# EAGLE schematic smartFootballTable (EAGLE 8.1.1)
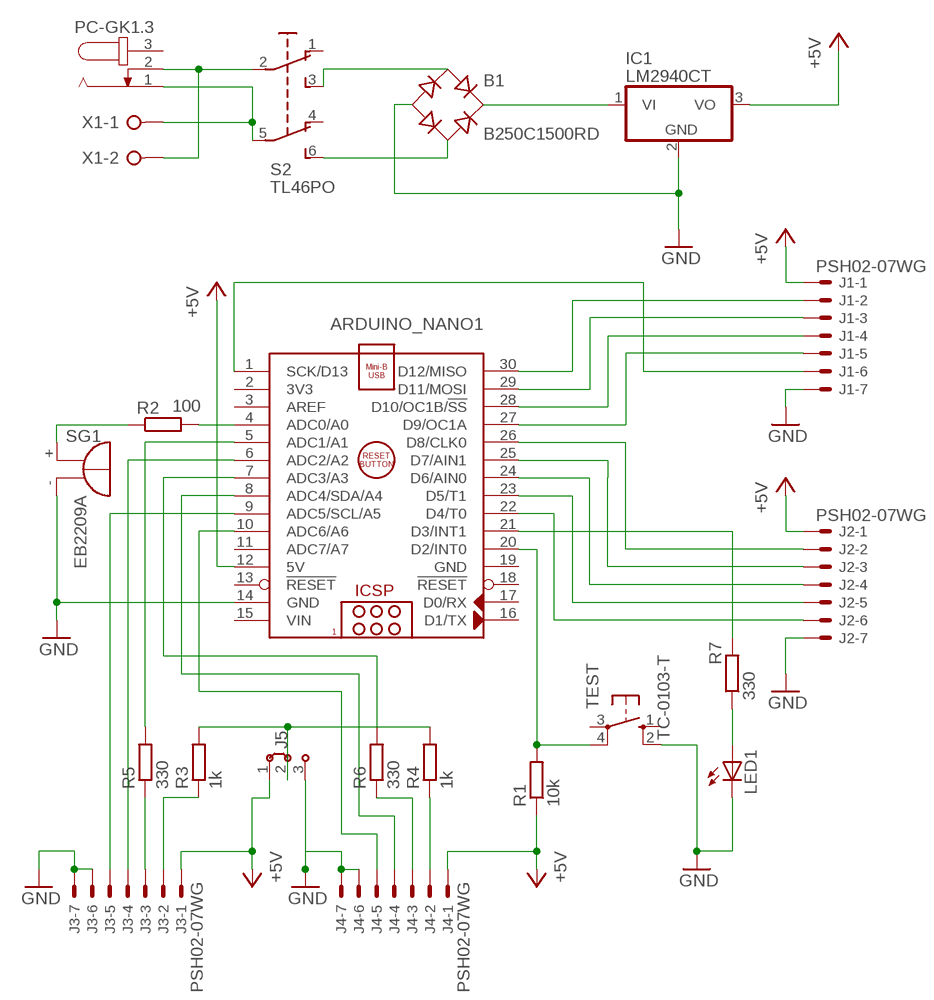
[diagram p0: schematic, sheet 1]

## Parts
ARDUINO_NANO1  ARDUINO_NANO  [ARDUINO_NANO]
B1  B250C1500RD  RECTIFIER-RB1A  [RB1A]
IC1  LM2940CT  LM340H-05  [TO220H]
J1  PSH02-07WG  C-GRID-07-70553  [70553-07]
J2  PSH02-07WG  C-GRID-07-70553  [70553-07]
J3  PSH02-07WG  C-GRID-07-70553  [70553-07]
J4  PSH02-07WG  C-GRID-07-70553  [70553-07]
J5  J2X2MM  [04C]
LED1  LED5MM  [LED5MM]
PC-GK1.3  JACK-PLUG0  [SPC4077]
R1  10k  R-EU_0204/7  [0204/7]
R2  100  R-EU_0204/7  [0204/7]
R3  1k  R-EU_0204/7  [0204/7]
R4  1k  R-EU_0204/7  [0204/7]
R5  330  R-EU_0204/7  [0204/7]
R6  330  R-EU_0204/7  [0204/7]
R7  330  R-EU_0204/7  [0204/7]
S2  TL46PO  [TL4XPO]
SG1  EB2209A  [EB2209A]
TEST  TC-0103-T  40-XX  [B3F-40XX]
X1  W237-02P  [W237-132]

## Nets
+5V: ARDUINO_NANO1.12(5V) IC1.3(VO) J1.1 J2.1 J3.1 J4.1 J5.1 R1.1
A0: ARDUINO_NANO1.4(ADC0/A0) R2.2
A1: ARDUINO_NANO1.5(ADC1/A1) R5.2
A2: ARDUINO_NANO1.6(ADC2/A2) J3.4
A3: ARDUINO_NANO1.7(ADC3/A3) R6.2
A4: ARDUINO_NANO1.8(ADC4/SDA/A4) J4.4
A5: ARDUINO_NANO1.9(ADC5/SCL/A5) J3.5
A6: ARDUINO_NANO1.10(ADC6/A6) J4.5
D2: ARDUINO_NANO1.20(D2/INT0) R1.2 TEST.4(P1)
D3: ARDUINO_NANO1.21(D3/INT1) R7.2
D4: ARDUINO_NANO1.22(D4/T0) J2.6
D5: ARDUINO_NANO1.23(D5/T1) J2.5
D6: ARDUINO_NANO1.24(D6/AIN0) J2.4
D7: ARDUINO_NANO1.25(D7/AIN1) J2.3
D8: ARDUINO_NANO1.26(D8/CLK0) J2.2
D9: ARDUINO_NANO1.27(D9/OC1A) J1.5
D10: ARDUINO_NANO1.28(D10/OC1B/!SS) J1.4
D11: ARDUINO_NANO1.29(D11/MOSI) J1.3
D12: ARDUINO_NANO1.30(D12/MISO) J1.2
D13: ARDUINO_NANO1.1(SCK/D13) J1.6
GND: ARDUINO_NANO1.14(GND) B1.- IC1.2(GND) J1.7 J2.7 J3.6 J3.7 J4.6 J4.7 J5.3 LED1.K(C) SG1.- TEST.2(S1)
N$2: B1.+ IC1.1(VI)
N$3: B1.AC2 S2.6(S1)
N$4: B1.AC1 S2.3(S)
N$8: R2.1 SG1.+
N$16: PC-GK1.3.1 S2.5(P1) X1.1
N$17: PC-GK1.3.2 S2.2(P) X1.2
N$20: J3.2 R3.1
N$21: J4.2 R4.1
N$22: J3.3 R5.1
N$23: J4.3 R6.1
N$25: LED1.A R7.1
N$31: J5.2 R3.2 R4.2
Unconnected: ARDUINO_NANO1.2(3V3) ARDUINO_NANO1.3(AREF) ARDUINO_NANO1.11(ADC7/A7) ARDUINO_NANO1.13(!RESET) ARDUINO_NANO1.16(D1/TX) ARDUINO_NANO1.17(D0/RX) ARDUINO_NANO1.18(!RESET) PC-GK1.3.3 S2.1(O) S2.4(O1) TEST.1(S) TEST.3(P)

## Power pins joined to a net without a drawn wire
GND: ARDUINO_NANO1.19(GND)
VIN: ARDUINO_NANO1.15(VIN)

## Library data of the parts
ARDUINO_NANO1 = ArduinoNanoV30:ARDUINO_NANO: Arduino Nano V3.0 Module Overview: The Arduino Nano is a small, complete, and breadboard-friendly board based on the ATmega328 (Arduino Nano 3.x) or ATmega168 (Arduino Nano 2.x). It has more or less the same functionality of the Arduino Duemilanove, but in a different package. It lacks only a DC power jack, and works with a Mini-B USB cable instead of a standard one. The Nano was designed and is being produced by Gravitech <http://www.gravitech.us/arna30wiatp.html>. General specifications: Item Value Microcontroller Atmel ATmega168 or ATmega328 Operating Voltage (logic level) 5 V Input Voltage (recommended) 7-12 V Input Voltage (limits) 6-20 V Digital I/O Pins 14 (of which 6 provide PWM output) Analog Input Pins 8 DC Current per I/O Pin 40 mA Flash Memory 16 KB (ATmega168) or 32 KB (ATmega328) of which 2 KB used by bootloader SRAM 1 KB (ATmega168) or 2 KB (ATmega328) EEPROM 512 bytes (ATmega168) or 1 KB (ATmega328) Clock Speed 16 MHz Dimensions (Inches) 0.73" x 1.70" Dimensions (mm) 18mm x 45mm Overall height About 9 mm (not including pins) Weigth 5 g Power: The Arduino Nano can be powered via the Mini-B USB connection, 6-20V unregulated external power supply (pin 30), or 5V regulated external power supply (pin 27). The power source is automatically selected to the highest voltage source. Memory: The ATmega168 has 16 KB of flash memory for storing code (of which 2 KB is used for the bootloader); the ATmega328 has 32 KB, (also with 2 KB used for the bootloader). The ATmega168 has 1 KB of SRAM and 512 bytes of EEPROM (which can be read and written with the EEPROM library); the ATmega328 has 2 KB of SRAM and 1 KB of EEPROM. Input and Output: Each of the 14 digital pins on the Nano can be used as an input or output, using pinMode(), digitalWrite(), and digitalRead() functions. They operate at 5 volts. Each pin can provide or receive a maximum of 40 mA and has an internal pull-up resistor (disconnected by default) of 20-50 kOhms. In addition, some pins have specialized functions. Visit Arduino - ArduinoBoardNano <https://www.arduino.cc/en/Main/ArduinoBoardNano>
B1 = rectifier:RECTIFIER-: Rectifier; OC_NEWARK: unknown
IC1 = linear:LM340?-*: Positive VOLTAGE REGULATOR Source: http://cache.national.com/ds/LM/LM340.pdf; MF: NATIONAL SEMICONDUCTOR; MPN: LM2940CT-5.0/NOPB; OC_NEWARK: 41K4577
J1-J4 = con-molex:C-GRID-07: CONNECTOR wire to board 2.54 mm (0.100") pitch header; OC_FARNELL: unknown; OC_NEWARK: unknown
J5 = jumper:J2: Jumper switch 2 x 2.5 mm
LED1 = led:LED: LED OSRAM: - CHIPLED LG R971, LG N971, LY N971, LG Q971, LY Q971, LO R971, LY R971 LH N974, LH R974 LS Q976, LO Q976, LY Q976 LO Q996 - Hyper CHIPLED LW Q18S LB Q993, LB Q99A, LB R99A - SideLED LS A670, LO A670, LY A670, LG A670, LP A670 LB A673, LV A673, LT A673, LW A673 LH A674 LY A675 LS A676, LA A676, LO A676, LY A676, LW A676 LS A679, LY A679, LG A679 - Hyper Micro SIDELED® LS Y876, LA Y876, LO Y876, LY Y876 LT Y87S - SmartLED LW L88C, LW L88S LB L89C, LB L89S, LG L890 LS L89K, LO L89K, LY L89K LS L896, LA L896, LO L896, LY L896 - TOPLED LS T670, LO T670, LY T670, LG T670, LP T670 LSG T670, LSP T670, LSY T670, LOP T670, LYG T670 LG T671, LOG T671, LSG T671 LB T673, LV T673, LT T673, LW T673 LH T674 LS T676, LA T676, LO T676, LY T676, LB T676, LH T676, LSB T676, LW T676 LB T67C, LV T67C, LT T67C, LS T67K, LO T67K, LY T67K, LW E67C LS E67B, LA E67B, LO E67B, LY E67B, LB E67C, LV E67C, LT E67C LW T67C LS T679, LY T679, LG T679 LS T770, LO T770, LY T770, LG T770, LP T770 LB T773, LV T773, LT T773, LW T773 LH T774 LS E675, LA E675, LY E675, LS T675 LS T776, LA T776, LO T776, LY T776, LB T776 LHGB T686 LT T68C, LB T68C - Hyper Mini TOPLED® LB M676 - Mini TOPLED Santana® LG M470 LS M47K, LO M47K, LY M47K Source: http://www.osram.convergy.de LUXEON: - LUMILED® LXK2-PW12-R00, LXK2-PW12-S00, LXK2-PW14-U00, LXK2-PW14-V00 LXK2-PM12-R00, LXK2-PM12-S00, LXK2-PM14-U00 LXK2-PE12-Q00, LXK2-PE12-R00, LXK2-PE12-S00, LXK2-PE14-T00, LXK2-PE14-U00 LXK2-PB12-K00, LXK2-PB12-L00, LXK2-PB12-M00, LXK2-PB14-N00, LXK2-PB14-P00, LXK2-PB14-Q00 LXK2-PR12-L00, LXK2-PR12-M00, LXK2-PR14-Q00, LXK2-PR14-R00 LXK2-PD12-Q00, LXK2-PD12-R00, LXK2-PD12-S00 LXK2-PH12-R00, LXK2-PH12-S00 LXK2-PL12-P00, LXK2-PL12-Q00, LXK2-PL12-R00 Source: www.luxeon.com KINGBRIGHT: KA-3528ASYC Source: www.kingbright.com; OC_NEWARK: unknown
PC-GK1.3 = con-jack:JACK-PLUG: DC POWER JACK Power Jack, DC, Right Angle, Through Hole, Rated 5A at 16VDC, PC Terminals Distributor: Farnell (www.Farnell.de) Drawing: 84N1161.pdf / 84N1162.pdf Manufacturer: SPC Technology (www.spctechnology.com) Type: SPC4077 / SPC 4078; OC_FARNELL: unknown; OC_NEWARK: unknown
R1-R7 = resistor:R-EU_: RESISTOR, European symbol; OC_NEWARK: unknown
S2 = switch:TL46PO: TINY SWITCH ON - ON Source: http://www2.produktinfo.conrad.com/datenblaetter/700000-724999/705152-da-01-de-Subminiaturschalter_TL_36YO.pdf
SG1 = buzzer:EB2209A: BUZZER Source: Buerklin; OC_FARNELL: unknown; OC_NEWARK: unknown
TEST = switch-omron:40-XX: OMRON SWITCH; MF: OMRON COMPONENTS USA; MPN: B3F-4000 BY OMZ; OC_FARNELL: 176434; OC_NEWARK: 36K3105
X1 = con-wago-508:W237-02P: WAGO SREW CLAMP; OC_FARNELL: unknown; OC_NEWARK: unknown